# Altium schematic sheet Main.SchDoc
size A4; CompanyName: WEITI ISE; Address1: ul. Nowowiejska 15/19; Address2: 00-665 Warszawa; DocumentNumber: 1; SheetNumber: 1; SheetTotal: 11
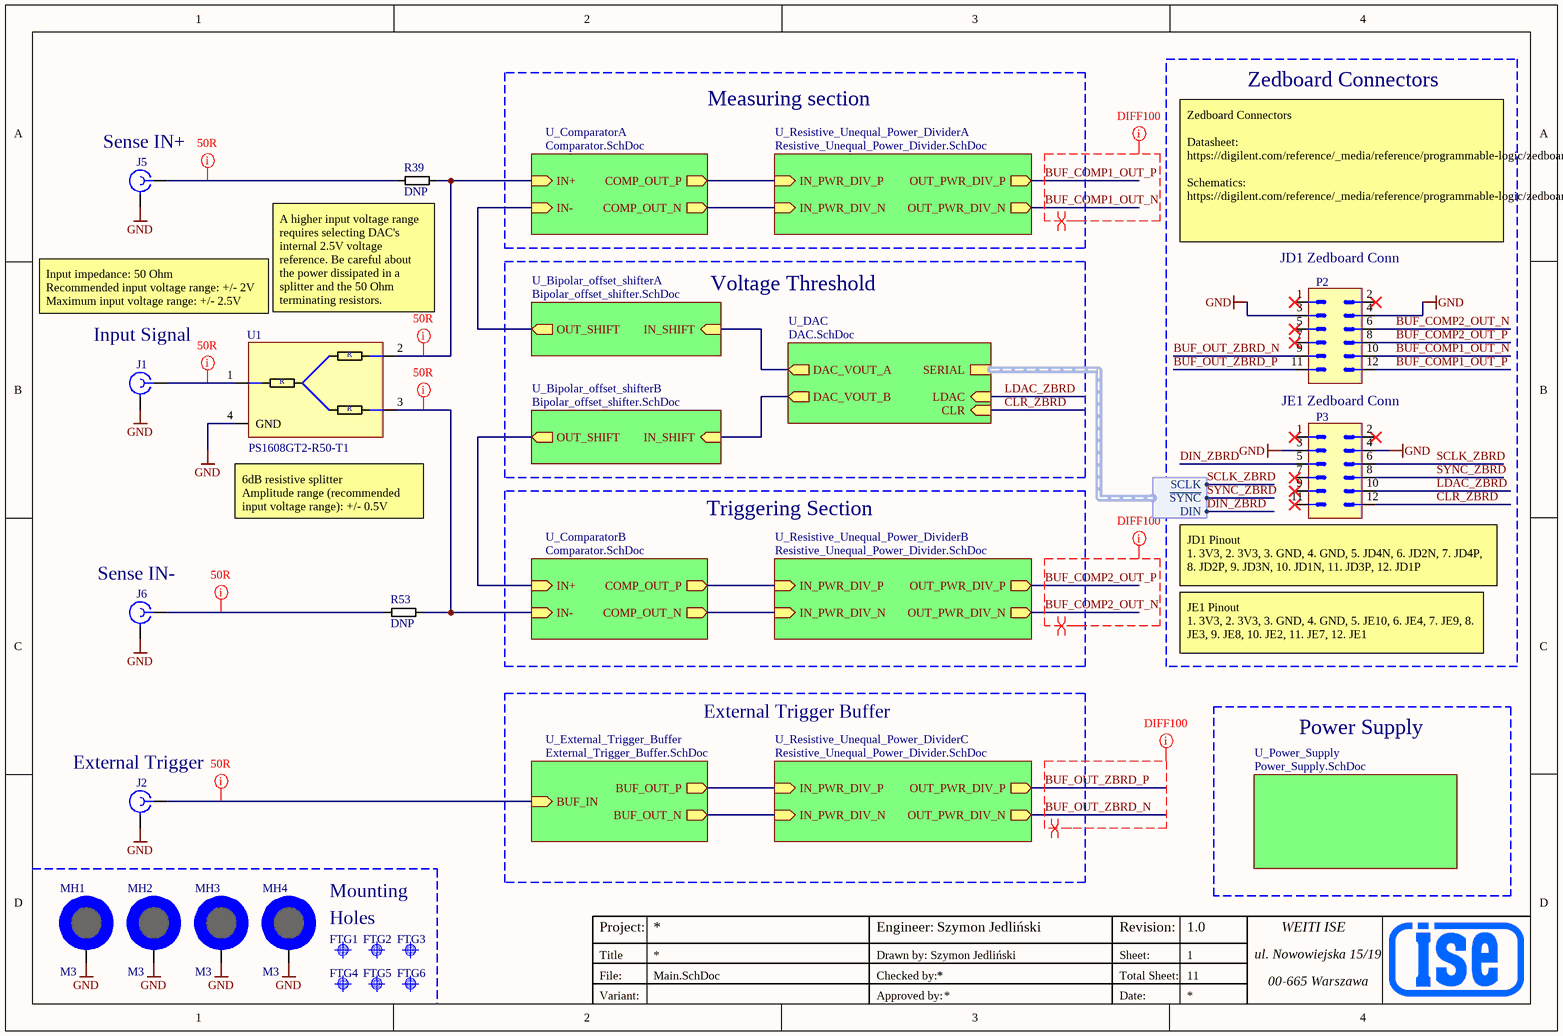
[diagram p0: Main.SchDoc]

## Parts
FTG1  Fiducial  [FIDUCIAL_TOP_S100-200]  (value not drawn)  (no BOM)
FTG2  Fiducial  [FIDUCIAL_TOP_S100-200]  (value not drawn)  (no BOM)
FTG3  Fiducial  [FIDUCIAL_TOP_S100-200]  (value not drawn)  (no BOM)
FTG4  Fiducial  [FIDUCIAL_BOT_S100-200]  (value not drawn)  (no BOM)
FTG5  Fiducial  [FIDUCIAL_BOT_S100-200]  (value not drawn)  (no BOM)
FTG6  Fiducial  [FIDUCIAL_BOT_S100-200]  (value not drawn)  (no BOM)
J1  CONSMA020.062-G  [CONSMA020.062-G]  (value not drawn)
J2  CONSMA020.062-G  [CONSMA020.062-G]  (value not drawn)
J5  CONSMA020.062-G  [CONSMA020.062-G]  (value not drawn)
J6  CONSMA020.062-G  [CONSMA020.062-G]  (value not drawn)
MH1  M3  [MH-M3_COPPER]  (no BOM)
MH2  M3  [MH-M3_COPPER]  (no BOM)
MH3  M3  [MH-M3_COPPER]  (no BOM)
MH4  M3  [MH-M3_COPPER]  (no BOM)
P2  WURTH_610112249121  [WURTH_610112249121]  (value not drawn)
P3  WURTH_610112249121  [WURTH_610112249121]  (value not drawn)
R39  DNP  [RESC0402X40N]
R53  DNP  [RESC0402X40N]
U1  PS1608GT2-R50-T1  [PS1608GT2R50T1]

## Blocks framed on the sheet
Zedboard Connectors: P2 P3

## Sub-sheets
U_Bipolar_offset_shifterA = Bipolar_offset_shifter.SchDoc: OUT_SHIFT (out), IN_SHIFT (in)
U_Bipolar_offset_shifterB = Bipolar_offset_shifter.SchDoc: OUT_SHIFT (out), IN_SHIFT (in)
U_ComparatorA = Comparator.SchDoc: IN+ (in), IN- (in), COMP_OUT_P (out), COMP_OUT_N (out)
U_ComparatorB = Comparator.SchDoc: IN- (in), IN+ (in), COMP_OUT_P (out), COMP_OUT_N (out)
U_DAC = DAC.SchDoc: SERIAL (harness SERIAL_DAC), LDAC (in), CLR (in), DAC_VOUT_A (out), DAC_VOUT_B (out)
U_External_Trigger_Buffer = External_Trigger_Buffer.SchDoc: BUF_IN (in), BUF_OUT_P (out), BUF_OUT_N (out)
U_Power_Supply = Power_Supply.SchDoc: no entries
U_Resistive_Unequal_Power_DividerA = Resistive_Unequal_Power_Divider.SchDoc: IN_PWR_DIV_P (in), OUT_PWR_DIV_P (out), IN_PWR_DIV_N (in), OUT_PWR_DIV_N (out)
U_Resistive_Unequal_Power_DividerB = Resistive_Unequal_Power_Divider.SchDoc: IN_PWR_DIV_P (in), OUT_PWR_DIV_P (out), IN_PWR_DIV_N (in), OUT_PWR_DIV_N (out)
U_Resistive_Unequal_Power_DividerC = Resistive_Unequal_Power_Divider.SchDoc: IN_PWR_DIV_P (in), OUT_PWR_DIV_P (out), IN_PWR_DIV_N (in), OUT_PWR_DIV_N (out)

## Harnesses
SERIAL_DAC: DIN, SCLK, ~{SYNC}

## Nets
GND: J1.2 J2.2 J5.2 J6.2 MH1.MH MH2.MH MH3.MH MH4.MH P2.3 P2.4 P3.3 P3.4 U1.4(GND)
BUF_COMP1_OUT_N: P2.10 ; sheet U_Resistive_Unequal_Power_DividerA/OUT_PWR_DIV_N
BUF_COMP1_OUT_P: P2.12 ; sheet U_Resistive_Unequal_Power_DividerA/OUT_PWR_DIV_P
BUF_COMP2_OUT_N: P2.6 ; sheet U_Resistive_Unequal_Power_DividerB/OUT_PWR_DIV_N
BUF_COMP2_OUT_P: P2.8 ; sheet U_Resistive_Unequal_Power_DividerB/OUT_PWR_DIV_P
BUF_OUT_ZBRD_N: P2.9 ; sheet U_Resistive_Unequal_Power_DividerC/OUT_PWR_DIV_N
BUF_OUT_ZBRD_P: P2.11 ; sheet U_Resistive_Unequal_Power_DividerC/OUT_PWR_DIV_P
CLR_ZBRD: P3.12 ; sheet U_DAC/CLR
DIN_ZBRD: P3.5 ; sheet U_DAC/SERIAL.DIN
LDAC_ZBRD: P3.10 ; sheet U_DAC/LDAC
SCLK_ZBRD: P3.6 ; sheet U_DAC/SERIAL.SCLK
SYNC_ZBRD: P3.8 ; sheet U_DAC/SERIAL.~{SYNC}
NetJ1_1: J1.1 U1.1
NetJ2_1: J2.1 ; sheet U_External_Trigger_Buffer/BUF_IN
NetJ5_1: J5.1 R39.2
NetJ6_1: J6.1 R53.1
NetR39_1: R39.1 U1.2 ; sheet U_ComparatorA/IN+
NetR53_2: R53.2 U1.3 ; sheet U_ComparatorB/IN-
(unnamed): sheet U_ComparatorA/IN-, sheet U_Bipolar_offset_shifterA/OUT_SHIFT
(unnamed): sheet U_ComparatorA/COMP_OUT_P, sheet U_Resistive_Unequal_Power_DividerA/IN_PWR_DIV_P
(unnamed): sheet U_ComparatorA/COMP_OUT_N, sheet U_Resistive_Unequal_Power_DividerA/IN_PWR_DIV_N
(unnamed): sheet U_ComparatorB/IN+, sheet U_Bipolar_offset_shifterB/OUT_SHIFT
(unnamed): sheet U_ComparatorB/COMP_OUT_P, sheet U_Resistive_Unequal_Power_DividerB/IN_PWR_DIV_P
(unnamed): sheet U_ComparatorB/COMP_OUT_N, sheet U_Resistive_Unequal_Power_DividerB/IN_PWR_DIV_N
(unnamed): sheet U_DAC/DAC_VOUT_A, sheet U_Bipolar_offset_shifterA/IN_SHIFT
(unnamed): sheet U_DAC/DAC_VOUT_B, sheet U_Bipolar_offset_shifterB/IN_SHIFT
(unnamed): sheet U_External_Trigger_Buffer/BUF_OUT_P, sheet U_Resistive_Unequal_Power_DividerC/IN_PWR_DIV_P
(unnamed): sheet U_External_Trigger_Buffer/BUF_OUT_N, sheet U_Resistive_Unequal_Power_DividerC/IN_PWR_DIV_N

Not connected (* = marked no-connect by the designer): P2 1* 2* 5* 7*; P3 1* 2* 7* 9* 11*

## Layout directives
net class SE50; CompClassName: SE50_LINE: NetJ1_1, NetJ2_1, NetJ5_1, NetJ6_1, NetR39_1, NetR53_2
mark named DIFF100: BUF_COMP1_OUT_N, BUF_COMP1_OUT_P, BUF_COMP2_OUT_N, BUF_COMP2_OUT_P, BUF_OUT_ZBRD_N, BUF_OUT_ZBRD_P
differential pair; differential pair class DIFF100_LINES; net class DIFF100: BUF_COMP1_OUT_N, BUF_COMP1_OUT_P, BUF_COMP2_OUT_N, BUF_COMP2_OUT_P, BUF_OUT_ZBRD_N, BUF_OUT_ZBRD_P

## Notes on the sheet
- Measuring section
- (near J5) Sense IN+
- Zedboard Connectors
  Datasheet:
  https://digilent.com/reference/_media/reference/programmable-logic/zedboard/zedboard_ug.pdf
  Schematics:
  https://digilent.com/reference/_media/reference/programmable-logic/zedboard/zedboard_sch.pdf
- Input impedance: 50 Ohm
  Recommended input voltage range: +/- 2V
  Maximum input voltage range: +/- 2.5V
- (near R39) A higher input voltage range requires selecting DAC's internal 2.5V voltage reference. Be careful about the power dissipated in a splitter and the 50 Ohm terminating resistors.
- Voltage Threshold
- (near P2) JD1 Zedboard Conn
- Input Signal
- JE1 Zedboard Conn
- (near U1) 6dB resistive splitter
  Amplitude range (recommended input voltage range): +/- 0.5V
- Triggering Section
- (near J6) Sense IN-
- (near P3) JD1 Pinout
  1. 3V3, 2. 3V3, 3. GND, 4. GND, 5. JD4N, 6. JD2N, 7. JD4P, 8. JD2P, 9. JD3N, 10. JD1N, 11. JD3P, 12. JD1P
- JE1 Pinout
  1. 3V3, 2. 3V3, 3. GND, 4. GND, 5. JE10, 6. JE4, 7. JE9, 8. JE3, 9. JE8, 10. JE2, 11. JE7, 12. JE1
- External Trigger Buffer
- (near J2) External Trigger
- Power Supply
- Mounting
- Holes
- Project:
- Title
- File:
- Drawn by:
- Engineer:
- Checked by:
- Szymon Jedliński
- Sheet:
- Revision:
- Total Sheet:
- 1.0
- Variant:
- Approved by:
- Date:
- (in symbol PS1608GT2-R50-T1) R

## Library data of the parts
FTG1-FTG3 = FIDUCIAL_TOP_S100-200: Square Fiducial Target, Top Layer, 1.0mm, Top Solder 2.0mm, Keepout =2.0mm; DesignItemId: FIDUCIAL_TOP_S100-200; Family: Fiducial; Part Description: Square Fiducial Target, Top Layer, 1.0mm, Top Solder 2.0mm, Keepout =2.0mm
FTG4-FTG6 = FIDUCIAL_BOT_S100-200: Square Fiducial Target, Bot Layer, 1.0mm, Bot Solder 2.0mm, Keepout =2.0mm; DesignItemId: FIDUCIAL_BOT_S100-200; Family: Fiducial; Part Description: Square Fiducial Target, Bot Layer, 1.0mm, Bot Solder 2.0mm, Keepout =2.0mm
J1 J2 J5 J6 = CONSMA020.062-G: Coaxial Connectors SMA, Edge Mount, Female Receptacle, 0.062" PCB Mount, Gold; Manufacturer 1 Component Height: 7.92mm; DesignItemId: CONSMA020.062-G; HelpURL: https://www.mouser.pl/datasheet/2/418/9/ENG_DS_L9000279_01_A-3238972.pdf; Manufacturer Part Number: CONSMA020.062-G; SMD: Yes
MH1-MH4 = MH-M3_C: Mounting hole, M3, exposed pad; DesignItemId: MH-M3_C; Family: M3; Part Description: Mounting hole, M3, exposed pad
P2 P3 = WURTH_610112249121: WR-PHD SMT Angled Dual Pin Header, 2.54mm, 2x6; Manufacturer 1 Component Height: 5.23mm; DesignItemId: WURTH_610112249121; HelpURL: https://www.we-online.com/components/products/datasheet/610112249121.pdf; Manufacturer Part Number: WURTH_610112249121; SMD: Yes
R39 R53 = R0402_DNP: General Purpose Thick Film Chip Resistor; Manufacturer 1 Component Height: 0.4mm; Voltage: 50V; DesignItemId: R0402_DNP; HelpURL: https://www.vishay.com/docs/20035/dcrcwe3.pdf; SMD: Yes; Value: DNP
U1 = PS1608GT2-R50-T1: Signal Conditioning 50 ohm 2 terminal Power Splitter; Manufacturer 1 Component Height: 0.5mm; DesignItemId: PS1608GT2-R50-T1; HelpURL: https://www.mouser.pl/datasheet/2/392/n_catalog_partition31_en-1660522.pdf; Manufacturer Part Number: PS1608GT2-R50-T1; SMD: Yes; Value: PS1608GT2-R50-T1